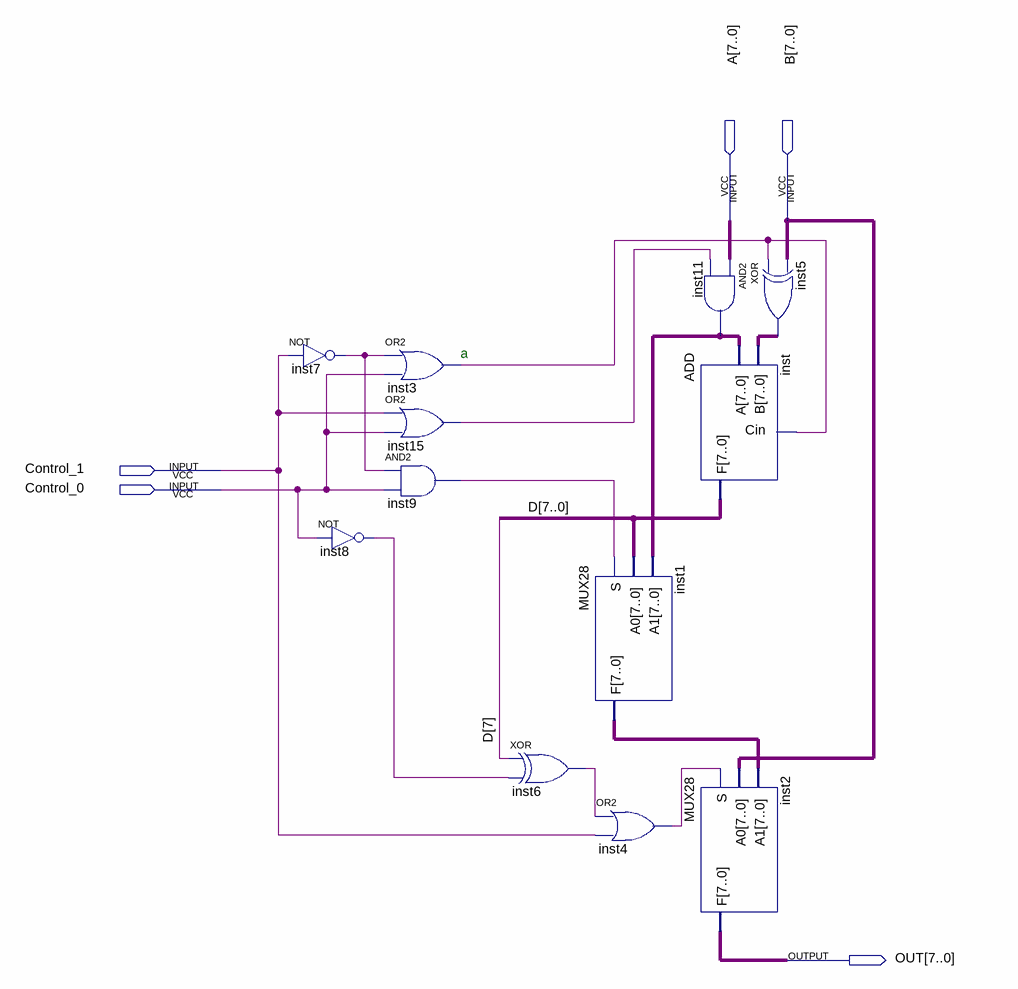
[diagram p0: schematic sheet]
// Quartus schematic ABS_MIN_ADD_SUB.bdf as structural Verilog: 12 symbols, 5 pins
module ABS_MIN_ADD_SUB (
  input  [7:0] A,
  input  [7:0] B,
  input  Control_1,
  input  Control_0,
  output [7:0] OUT
);

  wire inst3_out, inst4_out, inst6_out, inst7_out, inst8_out, inst9_out, inst15_out;
  wire [7:0] D, inst1_f, inst5_out, inst11_out;

  not inst7 (inst7_out, Control_1);
  not inst8 (inst8_out, Control_0);
  or inst3 (inst3_out, inst7_out, Control_0);
  or inst15 (inst15_out, Control_1, Control_0);
  and inst9 (inst9_out, inst7_out, Control_0);
  xor inst6 (inst6_out, D[7], inst8_out);
  MUX28 inst1 (.S(inst9_out), .A0(D), .A1(inst11_out), .F(inst1_f));
  or inst4 (inst4_out, inst6_out, Control_1);
  assign inst11_out = A & {8{inst15_out}};  // AND2 inst11, 8 bits wide
  ADD inst (.Cin(inst3_out), .A(inst11_out), .B(inst5_out), .F(D));
  MUX28 inst2 (.S(inst4_out), .A0(B), .A1(inst1_f), .F(OUT));
  assign inst5_out = {8{inst3_out}} ^ B;  // XOR inst5, 8 bits wide

  // Notes on the sheet:
  //   a
endmodule
